# Altium schematic sheet PXMC.SchDoc: 电动汽车电池管理系统
size A4; Address1: 先进成图技术赛道国赛试题; Address2: 陈大勇; Address3: 000000000000000000; Address4: DZ001; SheetNumber: 4; SheetTotal: 4
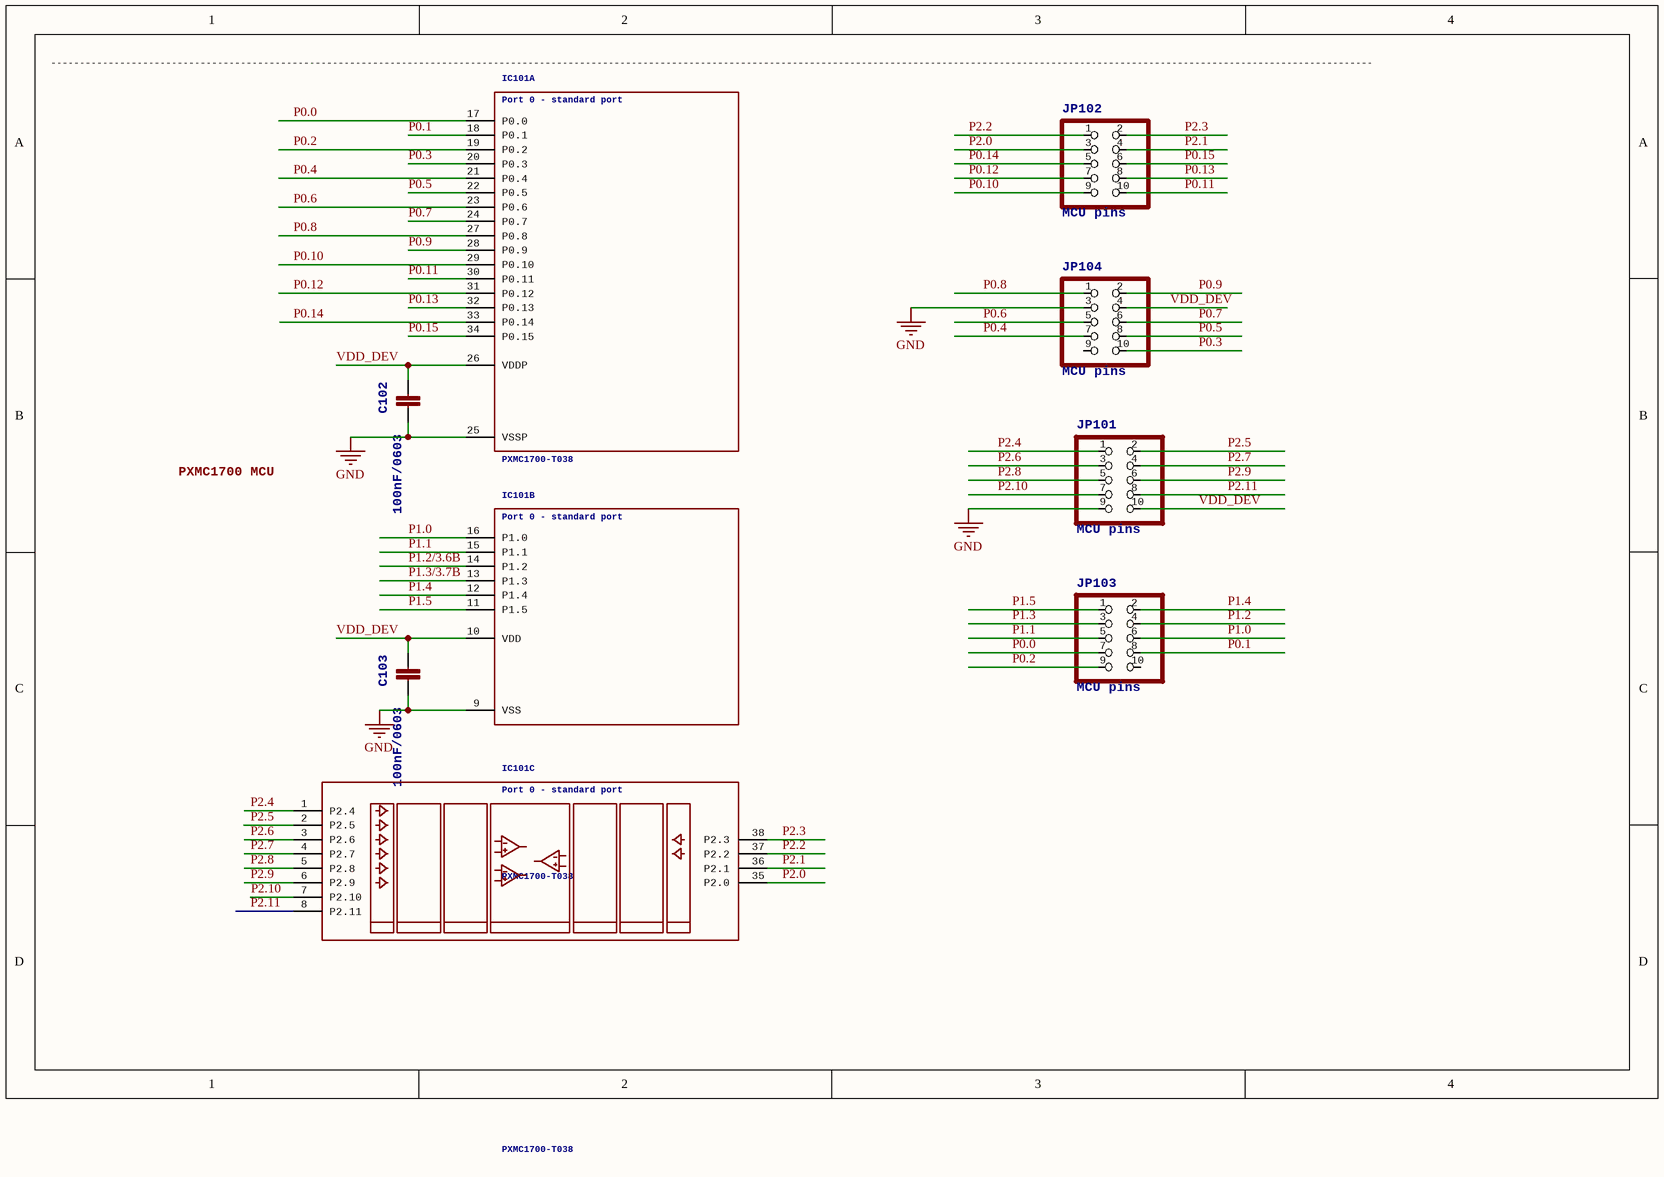
[diagram p0: PXMC.SchDoc]

## Parts
C102  100nF/0603  [RCL_C0603]
C103  100nF/0603  [RCL_C0603]
IC101  PXMC1700-T038  Port0-standardport: Port 0 - standard port  [P-TSSOP38-9]  (parts A,B,C of 3)
JP101  MCU pins  [2X05]
JP102  MCU pins  [2X05]
JP103  MCU pins  [2X05]
JP104  MCU pins  [2X05]

## Nets
GND: C102.2 C103.2 IC101.9(VSS) IC101.25(VSSP) JP101.9 JP104.3
P0.0: IC101.17(P0.0) JP103.7
P0.1: IC101.18(P0.1) JP103.8
P0.2: IC101.19(P0.2) JP103.9
P0.3: IC101.20(P0.3) JP104.10
P0.4: IC101.21(P0.4) JP104.7
P0.5: IC101.22(P0.5) JP104.8
P0.6: IC101.23(P0.6) JP104.5
P0.7: IC101.24(P0.7) JP104.6
P0.8: IC101.27(P0.8) JP104.1
P0.9: IC101.28(P0.9) JP104.2
P0.10: IC101.29(P0.10) JP102.9
P0.11: IC101.30(P0.11) JP102.10
P0.12: IC101.31(P0.12) JP102.7
P0.13: IC101.32(P0.13) JP102.8
P0.14: IC101.33(P0.14) JP102.5
P0.15: IC101.34(P0.15) JP102.6
P1.0: IC101.16(P1.0) JP103.6
P1.1: IC101.15(P1.1) JP103.5
P1.2: JP103.4
P1.2/3.6B: IC101.14(P1.2)
P1.3: JP103.3
P1.3/3.7B: IC101.13(P1.3)
P1.4: IC101.12(P1.4) JP103.2
P1.5: IC101.11(P1.5) JP103.1
P2.0: IC101.35(P2.0) JP102.3
P2.1: IC101.36(P2.1) JP102.4
P2.2: IC101.37(P2.2) JP102.1
P2.3: IC101.38(P2.3) JP102.2
P2.4: IC101.1(P2.4) JP101.1
P2.5: IC101.2(P2.5) JP101.2
P2.6: IC101.3(P2.6) JP101.3
P2.7: IC101.4(P2.7) JP101.4
P2.8: IC101.5(P2.8) JP101.5
P2.9: IC101.6(P2.9) JP101.6
P2.10: IC101.7(P2.10) JP101.7
P2.11: IC101.8(P2.11) JP101.8
VDD_DEV: C102.1 C103.1 IC101.10(VDD) IC101.26(VDDP) JP101.10 JP104.4

Not connected (* = marked no-connect by the designer): JP103 10; JP104 9

## Notes on the sheet
- PXMC1700 MCU
- 项目名称
- 选手信息
- 当前日期
- 图页名称
- 当前时间
- 第           幅
- 共           幅

## Library data of the parts
C102 C103 = RCL_C-EUC0603: CAPACITOR, European symbol
IC101 = XMC1000-T038
JP101-JP104 = PINHD-2X5: PIN HEADER